# EAGLE design backplane_v1.1-nochips (EAGLE 6.6.0)
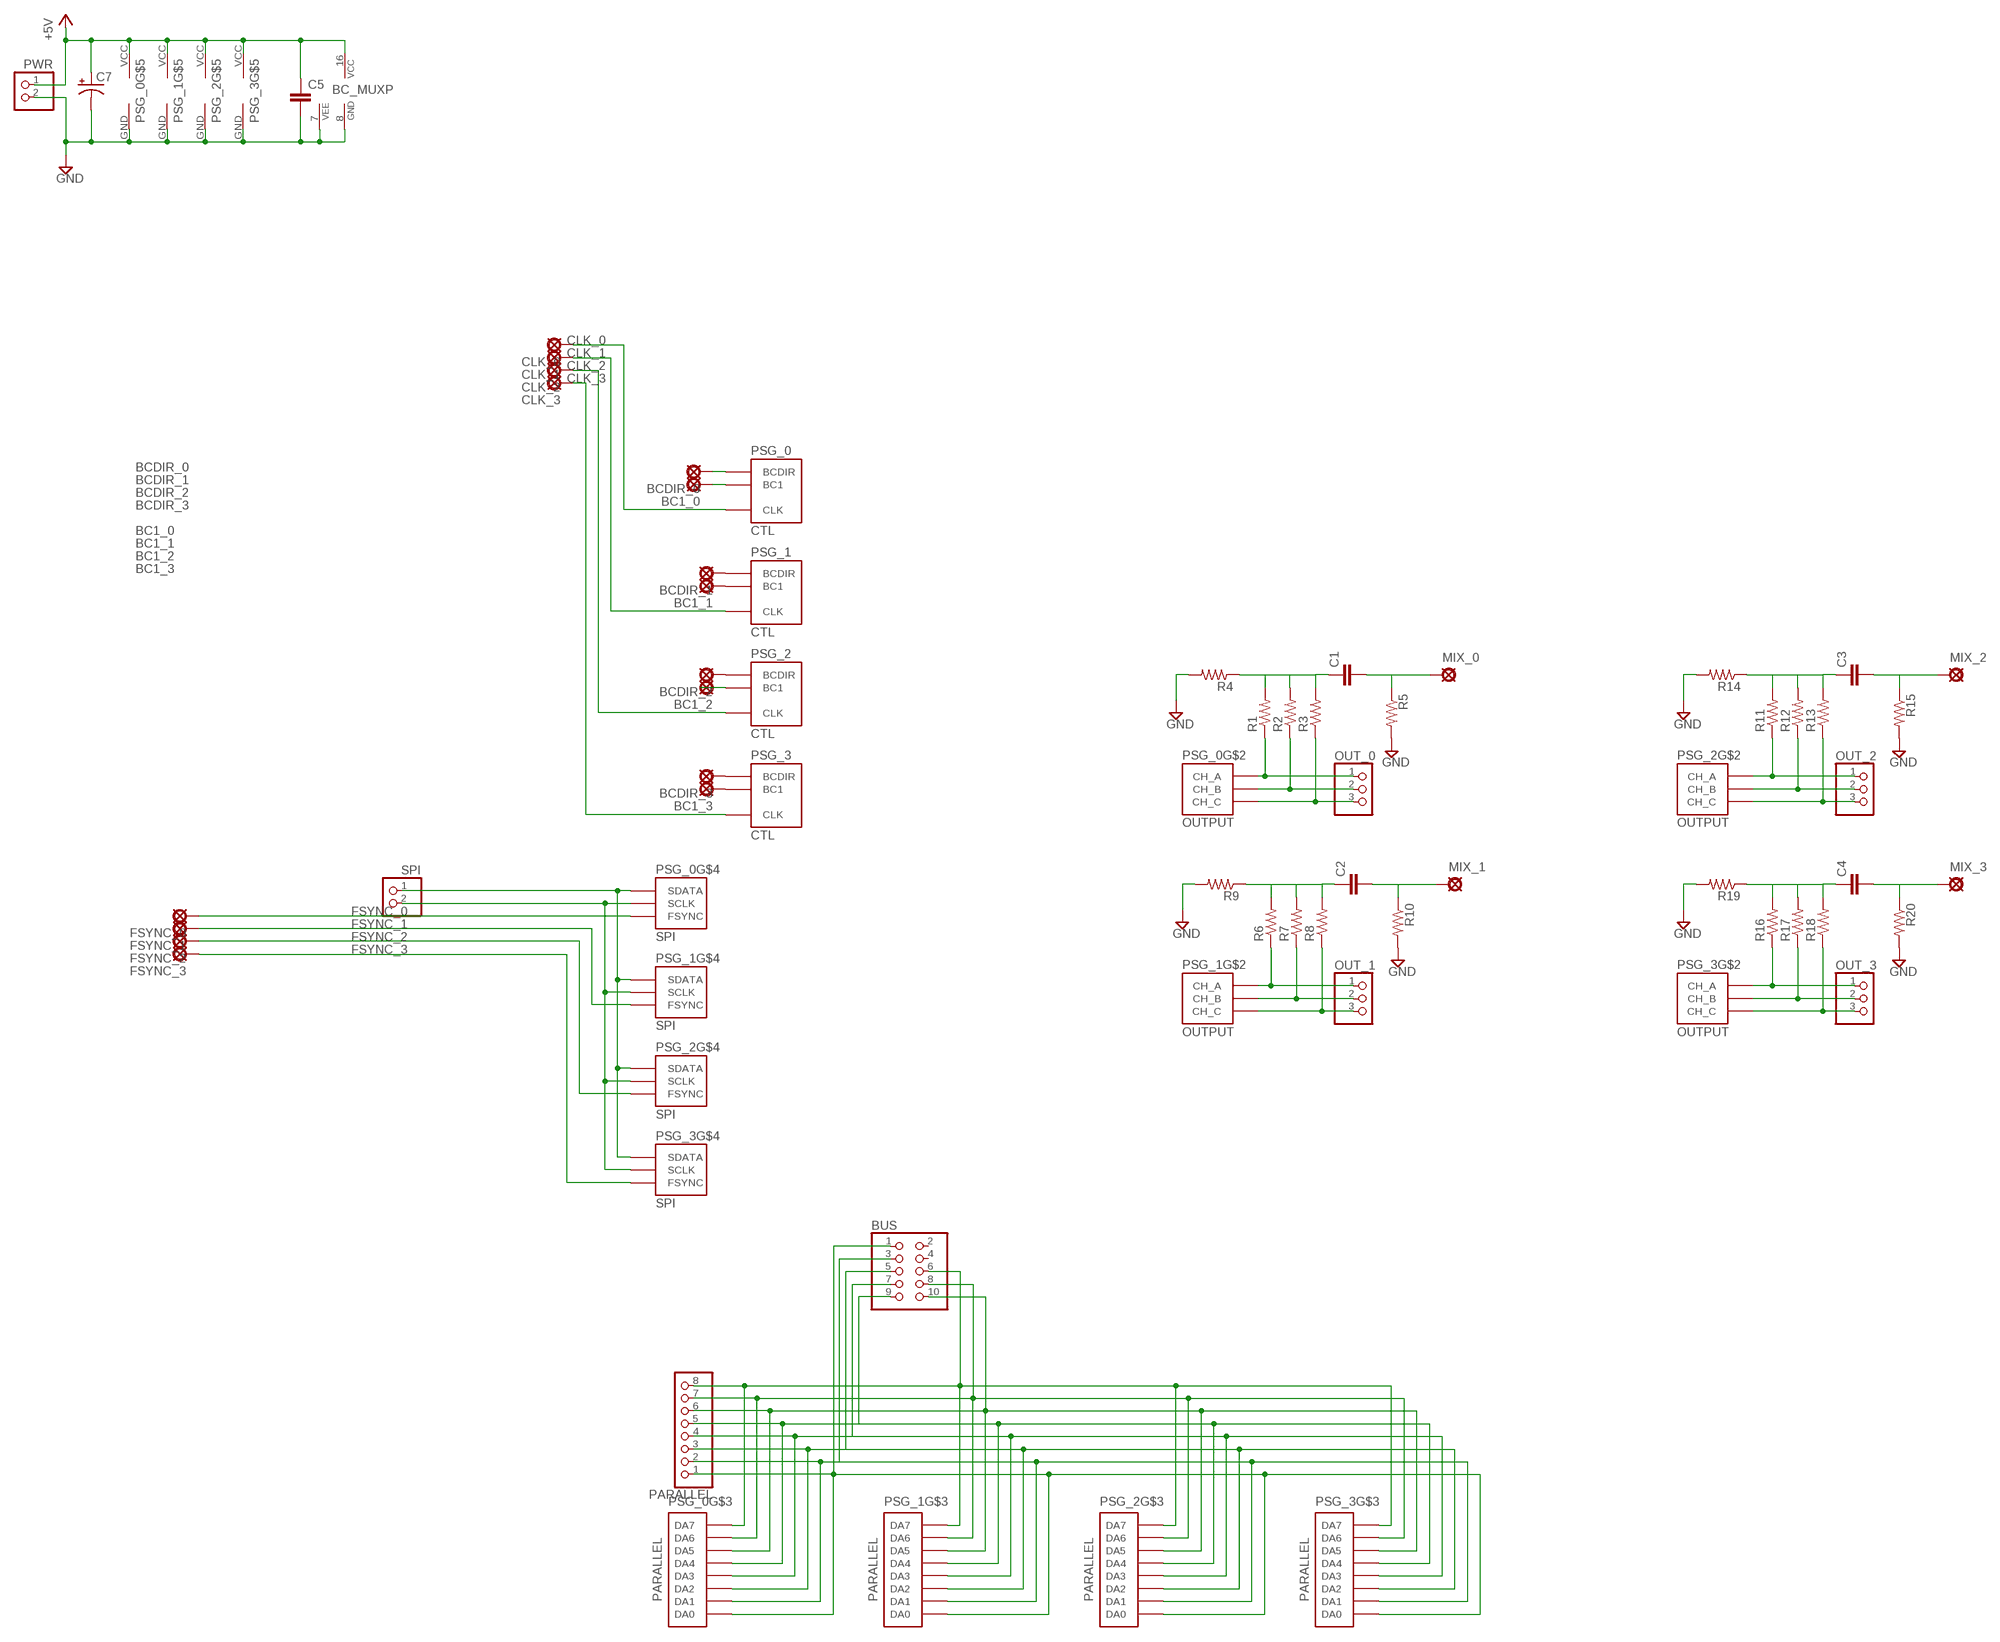
[diagram p0: schematic, sheet 1]

## Parts
BC1_0  PAD  [SQUARE]
BC1_1  PAD  [SQUARE]
BC1_2  PAD  [SQUARE]
BC1_3  PAD  [SQUARE]
BC_MUX  4052N  [DIL16]
BCDIR_0  PAD  [SQUARE]
BCDIR_1  PAD  [SQUARE]
BCDIR_2  PAD  [SQUARE]
BCDIR_3  PAD  [SQUARE]
BUS  PINHD-2X5IDC  [10PIN_IDC]
C1  070X0302  [070X030]
C2  070X0302  [070X030]
C3  070X0302  [070X030]
C4  070X0302  [070X030]
C5  050X030_0251  [050X030_025]
C7  0631  [063_025]
CLK_0  PAD  [SQUARE]
CLK_1  PAD  [SQUARE]
CLK_2  PAD  [SQUARE]
CLK_3  PAD  [SQUARE]
FSYNC_0  PAD  [SQUARE]
FSYNC_1  PAD  [SQUARE]
FSYNC_2  PAD  [SQUARE]
FSYNC_3  PAD  [SQUARE]
MIX_0  PAD  [SQUARE]
MIX_1  PAD  [SQUARE]
MIX_2  PAD  [SQUARE]
MIX_3  PAD  [SQUARE]
OUT_0  PINHD-1X3  [1X03]
OUT_1  PINHD-1X3  [1X03]
OUT_2  PINHD-1X3  [1X03]
OUT_3  PINHD-1X3  [1X03]
PARALLEL  PINHD-1X8  [1X08]
PSG_0  PSG_DAUGHTER  [PSG_DAUGHTER]
PSG_1  PSG_DAUGHTER  [PSG_DAUGHTER]
PSG_2  PSG_DAUGHTER  [PSG_DAUGHTER]
PSG_3  PSG_DAUGHTER  [PSG_DAUGHTER]
PWR  PINHD-1X2  [1X02]
R1  6MM.3  [R0207/3]
R2  6MM.3  [R0207/3]
R3  6MM.3  [R0207/3]
R4  6MM.3  [R0207/3]
R5  6MM.3  [R0207/3]
R6  6MM.3  [R0207/3]
R7  6MM.3  [R0207/3]
R8  6MM.3  [R0207/3]
R9  6MM.3  [R0207/3]
R10  6MM.3  [R0207/3]
R11  6MM.3  [R0207/3]
R12  6MM.3  [R0207/3]
R13  6MM.3  [R0207/3]
R14  6MM.3  [R0207/3]
R15  6MM.3  [R0207/3]
R16  6MM.3  [R0207/3]
R17  6MM.3  [R0207/3]
R18  6MM.3  [R0207/3]
R19  6MM.3  [R0207/3]
R20  6MM.3  [R0207/3]
SPI  PINHD-1X2  [1X02]

## Nets
+5V: BC_MUX.16(VCC) C5.1 C7.+ PSG_0.VCC PSG_1.VCC PSG_2.VCC PSG_3.VCC PWR.1
BC1_0: BC1_0.1(PAD) PSG_0.BC1
BC1_1: BC1_1.1(PAD) PSG_1.BC1
BC1_2: BC1_2.1(PAD) PSG_2.BC1
BC1_3: BC1_3.1(PAD) PSG_3.BC1
BCDIR_0: BCDIR_0.1(PAD) PSG_0.BCDIR
BCDIR_1: BCDIR_1.1(PAD) PSG_1.BCDIR
BCDIR_2: BCDIR_2.1(PAD) PSG_2.BCDIR
BCDIR_3: BCDIR_3.1(PAD) PSG_3.BCDIR
CLK_0: CLK_0.1(PAD) PSG_0.CLK
CLK_1: CLK_1.1(PAD) PSG_1.CLK
CLK_2: CLK_2.1(PAD) PSG_2.CLK
CLK_3: CLK_3.1(PAD) PSG_3.CLK
FSYNC_0: FSYNC_0.1(PAD) PSG_0.FSYNC
FSYNC_1: FSYNC_1.1(PAD) PSG_1.FSYNC
FSYNC_2: FSYNC_2.1(PAD) PSG_2.FSYNC
FSYNC_3: FSYNC_3.1(PAD) PSG_3.FSYNC
GND: BC_MUX.7(VEE) BC_MUX.8(GND) C5.2 C7.- PSG_0.GND PSG_1.GND PSG_2.GND PSG_3.GND PWR.2 R4.2 R5.2 R9.2 R10.2 R14.2 R15.2 R19.2 R20.2
N$1: C1.1 R1.2 R2.2 R3.2 R4.1
N$5: C1.2 MIX_0.1(PAD) R5.1
N$8: C2.1 R6.2 R7.2 R8.2 R9.1
N$9: C2.2 MIX_1.1(PAD) R10.1
N$13: C3.1 R11.2 R12.2 R13.2 R14.1
N$14: C3.2 MIX_2.1(PAD) R15.1
N$16: BUS.6 PARALLEL.8 PSG_0.DA7 PSG_1.DA7 PSG_2.DA7 PSG_3.DA7
N$17: BUS.1 PARALLEL.1 PSG_0.DA0 PSG_1.DA0 PSG_2.DA0 PSG_3.DA0
N$18: BUS.3 PARALLEL.2 PSG_0.DA1 PSG_1.DA1 PSG_2.DA1 PSG_3.DA1
N$19: BUS.5 PARALLEL.3 PSG_0.DA2 PSG_1.DA2 PSG_2.DA2 PSG_3.DA2
N$20: BUS.7 PARALLEL.4 PSG_0.DA3 PSG_1.DA3 PSG_2.DA3 PSG_3.DA3
N$21: BUS.9 PARALLEL.5 PSG_0.DA4 PSG_1.DA4 PSG_2.DA4 PSG_3.DA4
N$22: BUS.10 PARALLEL.6 PSG_0.DA5 PSG_1.DA5 PSG_2.DA5 PSG_3.DA5
N$23: BUS.8 PARALLEL.7 PSG_0.DA6 PSG_1.DA6 PSG_2.DA6 PSG_3.DA6
N$24: OUT_0.1 PSG_0.OUT_A(CH_A) R1.1
N$25: OUT_0.2 PSG_0.OUT_B(CH_B) R2.1
N$26: OUT_0.3 PSG_0.OUT_C(CH_C) R3.1
N$27: OUT_1.1 PSG_1.OUT_A(CH_A) R6.1
N$28: OUT_1.2 PSG_1.OUT_B(CH_B) R7.1
N$29: OUT_1.3 PSG_1.OUT_C(CH_C) R8.1
N$30: OUT_2.1 PSG_2.OUT_A(CH_A) R11.1
N$31: OUT_2.2 PSG_2.OUT_B(CH_B) R12.1
N$32: OUT_2.3 PSG_2.OUT_C(CH_C) R13.1
N$33: OUT_3.1 PSG_3.OUT_A(CH_A) R16.1
N$34: OUT_3.2 PSG_3.OUT_B(CH_B) R17.1
N$35: OUT_3.3 PSG_3.OUT_C(CH_C) R18.1
N$38: C4.1 R16.2 R17.2 R18.2 R19.1
N$39: C4.2 MIX_3.1(PAD) R20.1
SCLK: PSG_0.SCLK PSG_1.SCLK PSG_2.SCLK PSG_3.SCLK SPI.2
SDATA: PSG_0.SDATA PSG_1.SDATA PSG_2.SDATA PSG_3.SDATA SPI.1
Unconnected: BC_MUX.1(Y0) BC_MUX.2(Y2) BC_MUX.3(Y) BC_MUX.4(Y3) BC_MUX.5(Y1) BC_MUX.6(INH) BC_MUX.9(B) BC_MUX.10(A) BC_MUX.11(X3) BC_MUX.12(X0) BC_MUX.13(X) BC_MUX.14(X1) BC_MUX.15(X2) BUS.2 BUS.4

## Library data of the parts
BC1_0 BC1_1-BC1_3 BCDIR_0 BCDIR_1-BCDIR_3 CLK_0 CLK_1-CLK_3 FSYNC_0 FSYNC_1-FSYNC_3 MIX_0 MIX_1-MIX_3 = gm-supply:PAD: PAD use this package for pads with any purpose, including input, output, send or return various pad shapes: round, square, octogonal, long, and long offset
BC_MUX = 40xx:4052: Dual 4-channel ANALOG MULTIPLEXER
BUS = jaapie:PINHD-2X5: PIN HEADER
C1-C4 = gm-caps-film-chicklet:070X030: 0.0001 - .01uF (100 - 10,000pF) Panasonic ECQ-B 7mm x 3mm 50 or 63V: 0.0001 - .01uF (100 - 10,000pF);
C5 = gm-caps-ceramic:050X030_025: 47 - 120pF Xicon Ceramic Disc 2.5mm lead spacing
C7 = gm-caps-electro-pol:063: 33 - 220uF Xicon values at Mouser.com 10V: 220uF; 16V: 100uF; 25V: 100uF; 50V: 33uF
OUT_0 OUT_1-OUT_3 = pinhead:PINHD-1X3: PIN HEADER
PARALLEL = pinhead:PINHD-1X8: PIN HEADER
PSG_0 PSG_1-PSG_3 = jaapie:PSG_DAUGHTER
PWR SPI = pinhead:PINHD-1X2: PIN HEADER
R1-R20 = gm-resistors:6MM: 6mm Resistors Leads spaced 1-6 holes apart for 0.1" perfboard. Suitable for 1/4 watt resistors.

## Board
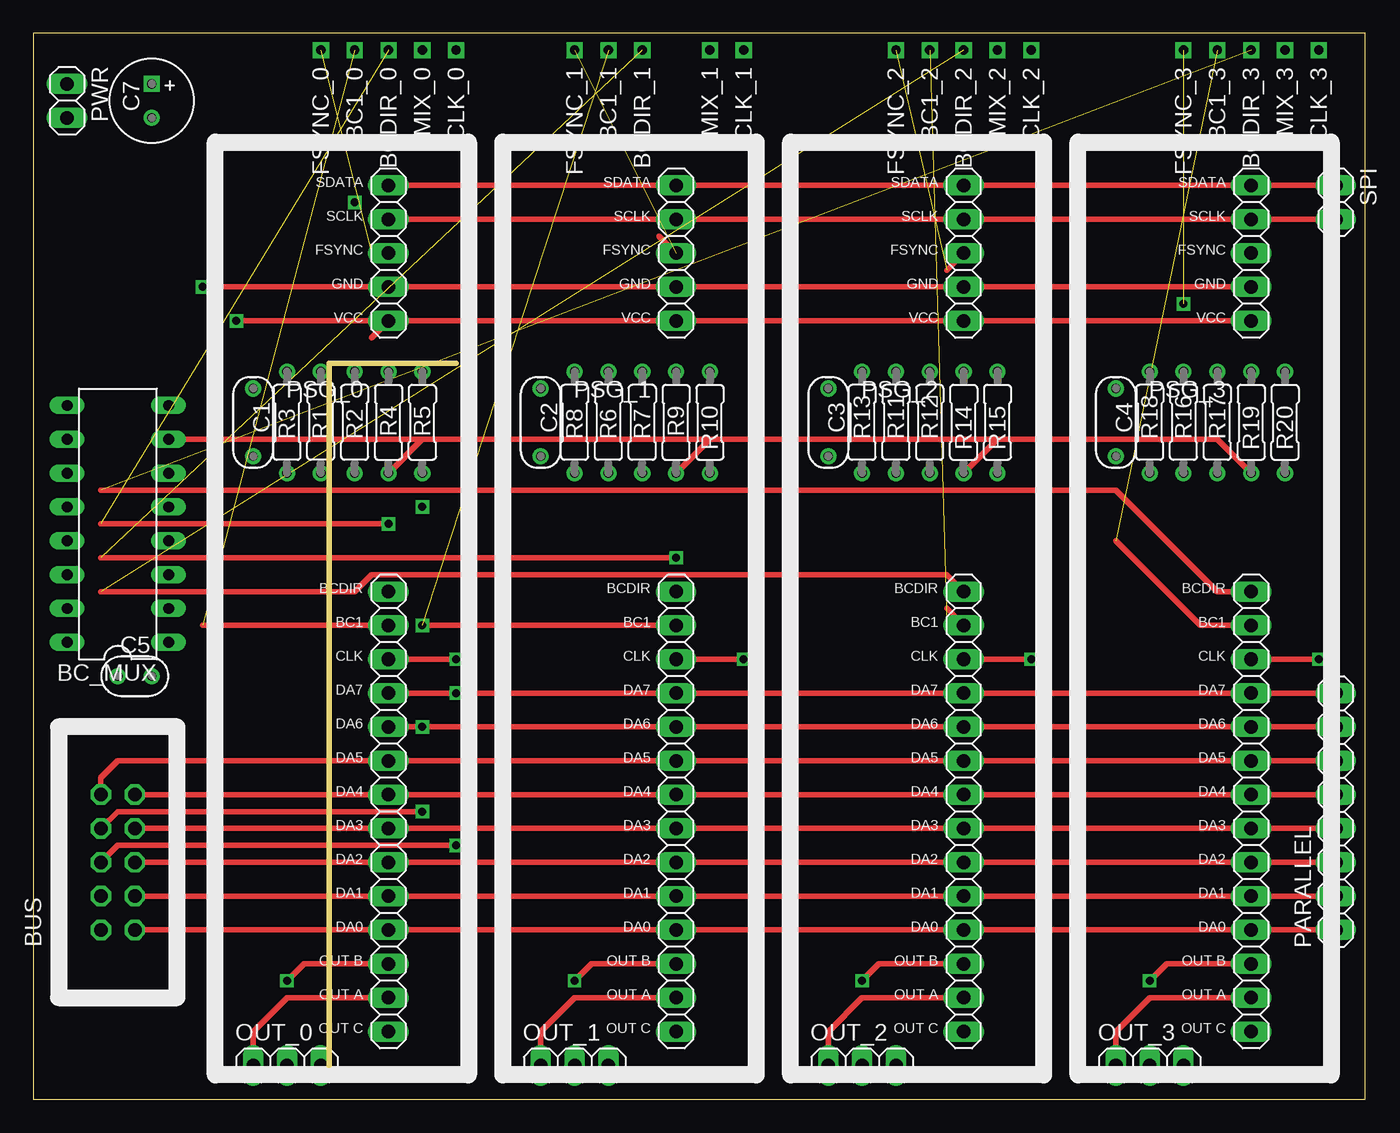
[diagram p1: board, top side]
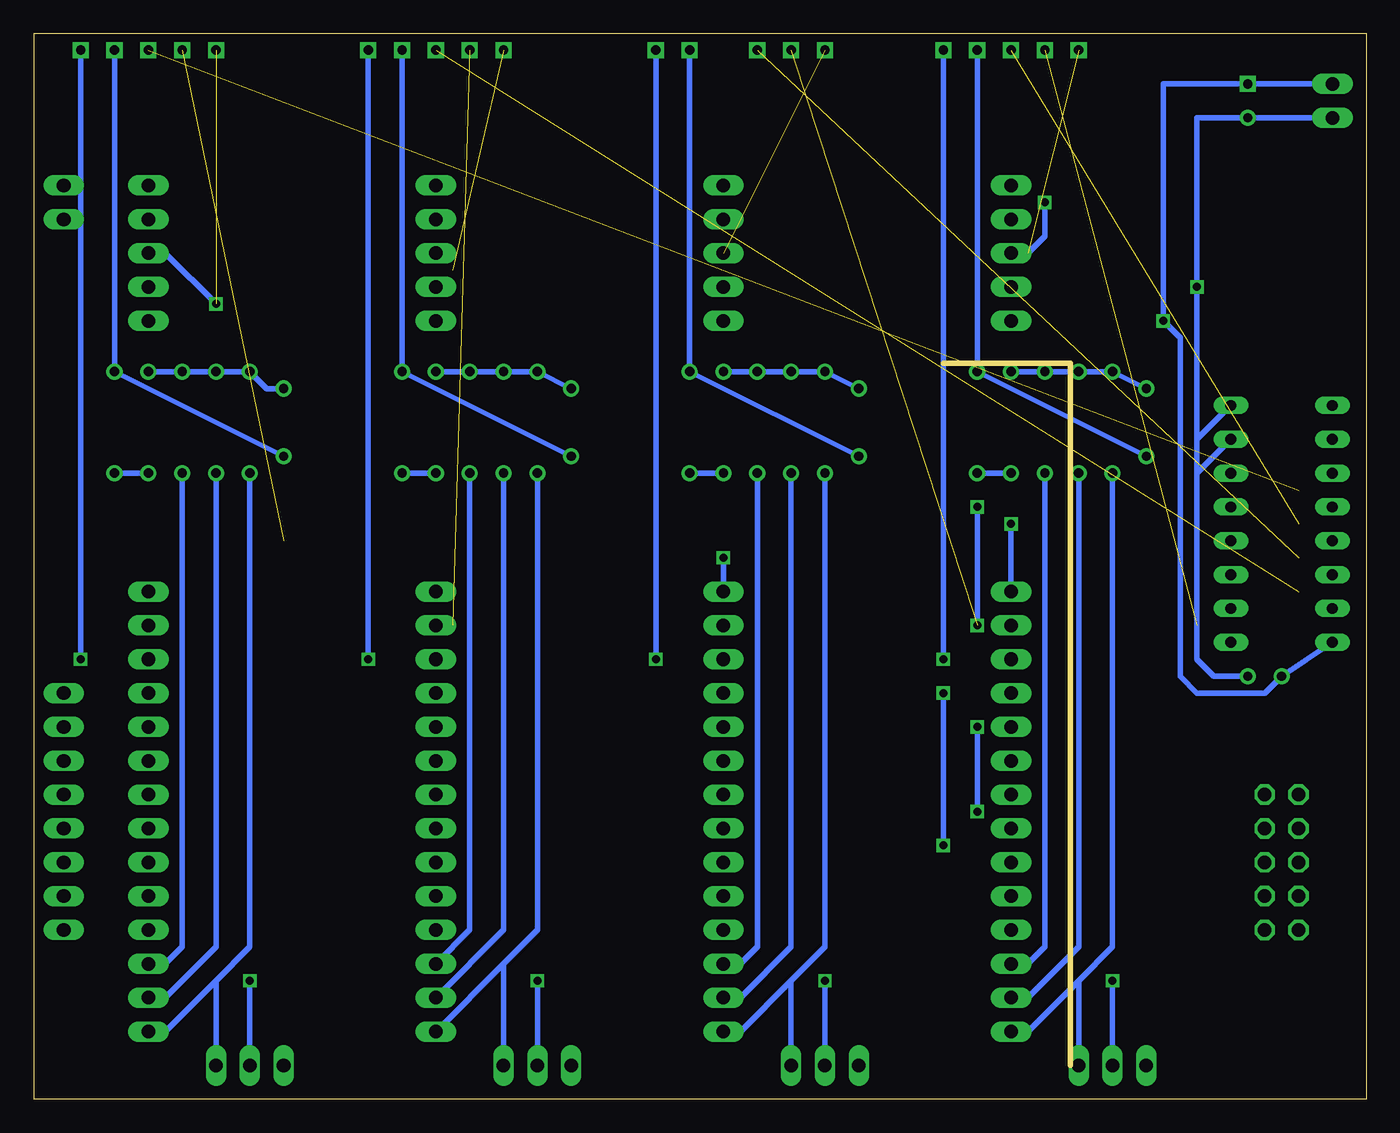
[diagram p2: board, bottom side, seen from below]

Size 100 x 80 mm. Coordinates in mm from the lower left corner, seen from the top.
Outline: 22.23,2.54 22.23,55.24 31.75,55.24
Outline: 0,0 100,0 100,80 0,80 0,0
Copper layers (1*16): Top 0.035mm / dielectric 1.5mm / Bottom 0.035mm
Design rules "default": minimum track width 10mil, minimum drill 24mil, track to track 8mil, track to pad 8mil, pad to pad 8mil, via to via 8mil, smd to smd 8mil, copper to edge 40mil, drill to drill 8mil, minimum pad ring 10mil, minimum via ring 8mil, stop-mask expansion 4mil, vias tented up to drill 0mil, thermal gap 10mil

### Footprints (pad centres in the part's own frame; a part is rotated, then mirrored left to right if it is on the bottom)
SQUARE = drill 0.7 square: 1 0,0
DIL16 = drill 0.813 long: 1 -8.89,-3.81; 2 -6.35,-3.81; 3 -3.81,-3.81; 4 -1.27,-3.81; 5 1.27,-3.81; 6 3.81,-3.81; 7 6.35,-3.81; 8 8.89,-3.81; 9 8.89,3.81; 10 6.35,3.81; 11 3.81,3.81; 12 1.27,3.81; 13 -1.27,3.81; 14 -3.81,3.81; 15 -6.35,3.81; 16 -8.89,3.81
10PIN_IDC = drill 1.016 octagon: 1 -5.08,-1.27; 2 -5.08,1.27; 3 -2.54,-1.27; 4 -2.54,1.27; 5 0,-1.27; 6 0,1.27; 7 2.54,-1.27; 8 2.54,1.27; 9 5.08,-1.27; 10 5.08,1.27
070X030 = drill 0.7: 1 -2.54,0; 2 2.54,0
050X030_025 = drill 0.7: 1 -1.27,0; 2 1.27,0
063_025 = drill 0.7 square: + -1.27,0 | drill 0.7: - 1.27,0
1X03 = drill 1.016 long: 1 -2.54,0; 2 0,0; 3 2.54,0
1X08 = drill 1.016 long: 1 -8.89,0; 2 -6.35,0; 3 -3.81,0; 4 -1.27,0; 5 1.27,0; 6 3.81,0; 7 6.35,0; 8 8.89,0
PSG_DAUGHTER = drill 1.016 long: BC1 0,-1.27; BCDIR 0,1.27; CLK 0,-3.81; DA0 0,-24.13; DA1 0,-21.59; DA2 0,-19.05; DA3 0,-16.51; DA4 0,-13.97; DA5 0,-11.43; DA6 0,-8.89; DA7 0,-6.35; FSYNC 0,26.67; GND 0,24.13; OUT_A 0,-29.21; OUT_B 0,-26.67; OUT_C 0,-31.75; SCLK 0,29.21; SDATA 0,31.75; VCC 0,21.59
1X02 = drill 1.016 long: 1 -1.27,0; 2 1.27,0
R0207/3 = drill 0.7: 1 -3.81,0; 2 3.81,0

### Placement (x,y rotation side)
BC1_0  24.13,78.74 270 top
BC1_1  43.18,78.74 270 top
BC1_2  67.31,78.74 270 top
BC1_3  88.9,78.74 270 top
BC_MUX  6.35,43.18 90 top
BCDIR_0  26.67,78.74 270 top
BCDIR_1  45.72,78.74 270 top
BCDIR_2  69.85,78.74 270 top
BCDIR_3  91.44,78.74 270 top
BUS  6.35,17.78 90 top
C1  16.51,50.8 270 top
C2  38.1,50.8 270 top
C3  59.69,50.8 270 top
C4  81.28,50.8 270 top
C5  7.62,31.75 0 top
C7  8.89,74.93 270 top
CLK_0  31.75,78.74 270 top
CLK_1  53.34,78.74 270 top
CLK_2  74.93,78.74 270 top
CLK_3  96.52,78.74 270 top
FSYNC_0  21.59,78.74 270 top
FSYNC_1  40.64,78.74 270 top
FSYNC_2  64.77,78.74 270 top
FSYNC_3  86.36,78.74 270 top
MIX_0  29.21,78.74 270 top
MIX_1  50.8,78.74 270 top
MIX_2  72.39,78.74 270 top
MIX_3  93.98,78.74 270 top
OUT_0  19.05,2.54 0 top
OUT_1  40.64,2.54 0 top
OUT_2  62.23,2.54 0 top
OUT_3  83.82,2.54 0 top
PARALLEL  97.79,21.59 90 top
PSG_0  26.67,36.83 0 top
PSG_1  48.26,36.83 0 top
PSG_2  69.85,36.83 0 top
PSG_3  91.44,36.83 0 top
PWR  2.54,74.93 270 top
R1  21.59,50.8 90 top
R2  24.13,50.8 90 top
R3  19.05,50.8 90 top
R4  26.67,50.8 270 top
R5  29.21,50.8 270 top
R6  43.18,50.8 90 top
R7  45.72,50.8 90 top
R8  40.64,50.8 90 top
R9  48.26,50.8 270 top
R10  50.8,50.8 270 top
R11  64.77,50.8 90 top
R12  67.31,50.8 90 top
R13  62.23,50.8 90 top
R14  69.85,50.8 270 top
R15  72.39,50.8 270 top
R16  86.36,50.8 90 top
R17  88.9,50.8 90 top
R18  83.82,50.8 90 top
R19  91.44,50.8 270 top
R20  93.98,50.8 270 top
SPI  97.79,67.31 270 top

### Tracks (layer width: path | path; a pad name or v marks a point on that pad's centre or on a via)
+5V  (via drill 0.6)
  Top 0.406: PSG_3.VCC PSG_2.VCC PSG_1.VCC PSG_0.VCC | PSG_0.VCC 25.4,57.15 | PSG_0.VCC v15.24,58.42
  Bottom 0.406: BC_MUX.16 C5.1 7.62,30.48 12.7,30.48 13.97,31.75 13.97,57.15 v15.24,58.42 15.24,76.2 C7.+ PWR.1
BC1_0  (1 unrouted)
  Top 0.406: PSG_0.BC1 12.7,35.56
BC1_1  (via drill 0.6)  (1 unrouted)
  Top 0.406: v29.21,35.56 PSG_1.BC1
  Bottom 0.406: v29.21,44.45 v29.21,35.56
BC1_2  (1 unrouted)
  Top 0.406: 68.58,35.56 PSG_2.BC1 68.58,36.83
BC1_3  (1 unrouted)
  Top 0.406: 81.28,41.91 87.63,35.56 PSG_3.BC1
BCDIR_0  (via drill 0.6)  (1 unrouted)
  Top 0.406: 5.08,43.18 v26.67,43.18
  Bottom 0.406: PSG_0.BCDIR v26.67,43.18
BCDIR_1  (via drill 0.6)  (1 unrouted)
  Top 0.406: 5.08,40.64 v48.26,40.64
  Bottom 0.406: v48.26,40.64 PSG_1.BCDIR
BCDIR_2  (1 unrouted)
  Top 0.406: PSG_2.BCDIR 68.58,39.37 25.4,39.37 24.13,38.1 5.08,38.1
BCDIR_3  (1 unrouted)
  Top 0.406: 5.08,45.72 81.28,45.72 88.9,38.1 PSG_3.BCDIR
CLK_0  (via drill 0.6)
  Top 0.406: PSG_0.CLK v31.75,33.02
  Bottom 0.406: v31.75,33.02 CLK_0.1
CLK_1  (via drill 0.6)
  Top 0.406: PSG_1.CLK v53.34,33.02
  Bottom 0.406: v53.34,33.02 CLK_1.1
CLK_2  (via drill 0.6)
  Top 0.406: PSG_2.CLK v74.93,33.02
  Bottom 0.406: v74.93,33.02 CLK_2.1
CLK_3  (via drill 0.6)
  Top 0.406: PSG_3.CLK v96.52,33.02
  Bottom 0.406: v96.52,33.02 CLK_3.1
FSYNC_0  (via drill 0.6)  (1 unrouted)
  Bottom 0.406: v24.13,67.31 24.13,64.77 25.4,63.5 PSG_0.FSYNC
FSYNC_1  (1 unrouted)
  Top 0.406: PSG_1.FSYNC 46.99,64.77
FSYNC_2  (1 unrouted)
  Top 0.406: PSG_2.FSYNC 68.58,62.23
FSYNC_3  (via drill 0.6)  (1 unrouted)
  Bottom 0.406: v86.36,59.69 90.17,63.5 PSG_3.FSYNC
GND  (via drill 0.6)
  Top 0.406: R14.2 72.39,49.53 | 50.8,49.53 29.21,49.53 | 72.39,49.53 88.9,49.53 R19.2 | R9.2 50.8,49.53 | 50.8,49.53 72.39,49.53 | R4.2 29.21,49.53 | 29.21,49.53 BC_MUX.7 | PSG_3.GND PSG_2.GND PSG_1.GND PSG_0.GND v12.7,60.96
  Bottom 0.406: R19.2 R20.2 | R5.2 R4.2 | R9.2 R10.2 | R14.2 R15.2 | PWR.2 C7.- 12.7,73.66 v12.7,60.96 12.7,49.53 | C5.2 11.43,31.75 12.7,33.02 12.7,46.99 | 12.7,46.99 BC_MUX.7 | 12.7,49.53 12.7,46.99 | BC_MUX.8 12.7,49.53
N$1
  Bottom 0.406: R4.1 R2.2 R1.2 R3.2 C1.1
N$5
  Bottom 0.406: C1.2 R5.1 MIX_0.1
N$8
  Bottom 0.406: R9.1 R8.2 | R8.2 R6.2 R7.2 | C2.1 R8.2
N$9
  Bottom 0.406: C2.2 R10.1 MIX_1.1
N$13
  Bottom 0.406: R14.1 R12.2 R11.2 R13.2 C3.1
N$14
  Bottom 0.406: C3.2 R15.1 MIX_2.1
N$16  (via drill 0.6)
  Top 0.406: PSG_0.DA7 v31.75,30.48 PSG_1.DA7 PSG_2.DA7 PSG_3.DA7 PARALLEL.8 | BUS.6 6.35,19.05 v31.75,19.05
  Bottom 0.406: v31.75,30.48 v31.75,19.05
N$17
  Top 0.406: PARALLEL.1 PSG_3.DA0 PSG_2.DA0 PSG_1.DA0 PSG_0.DA0 BUS.1
N$18
  Top 0.406: PARALLEL.2 PSG_3.DA1 PSG_2.DA1 PSG_1.DA1 PSG_0.DA1 BUS.3
N$19
  Top 0.406: PARALLEL.3 PSG_3.DA2 PSG_2.DA2 PSG_1.DA2 PSG_0.DA2 BUS.5
N$20
  Top 0.406: PARALLEL.4 PSG_3.DA3 PSG_2.DA3 PSG_1.DA3 PSG_0.DA3 BUS.7
N$21
  Top 0.406: PARALLEL.5 PSG_3.DA4 PSG_2.DA4 PSG_1.DA4 PSG_0.DA4 BUS.9
N$22
  Top 0.406: PARALLEL.6 PSG_3.DA5 PSG_2.DA5 PSG_1.DA5 PSG_0.DA5 6.35,25.4 5.08,24.13 BUS.10
N$23  (via drill 0.6)
  Top 0.406: PSG_0.DA6 v29.21,27.94 PSG_1.DA6 PSG_2.DA6 PSG_3.DA6 PARALLEL.7 | BUS.8 6.35,21.59 v29.21,21.59
  Bottom 0.406: v29.21,27.94 v29.21,21.59
N$24
  Top 0.406: OUT_0.1 16.51,5.08 19.05,7.62 PSG_0.OUT_A
  Bottom 0.406: PSG_0.OUT_A 25.4,7.62 21.59,11.43 R1.1
N$25  (via drill 0.6)
  Top 0.406: v19.05,8.89 20.32,10.16 PSG_0.OUT_B
  Bottom 0.406: R2.1 24.13,11.43 25.4,10.16 PSG_0.OUT_B | OUT_0.2 v19.05,8.89
N$26
  Bottom 0.406: R3.1 19.05,11.43 21.59,8.89 | 21.59,8.89 25.4,5.08 PSG_0.OUT_C | OUT_0.3 21.59,8.89
N$27
  Top 0.406: OUT_1.1 38.1,5.08 40.64,7.62 PSG_1.OUT_A
  Bottom 0.406: PSG_1.OUT_A 46.99,7.62 43.18,11.43 R6.1
N$28  (via drill 0.6)
  Top 0.406: v40.64,8.89 41.91,10.16 PSG_1.OUT_B
  Bottom 0.406: R7.1 45.72,11.43 46.99,10.16 PSG_1.OUT_B | OUT_1.2 v40.64,8.89
N$29
  Bottom 0.406: PSG_1.OUT_C 46.99,5.08 43.18,8.89 | 43.18,8.89 40.64,11.43 R8.1 | OUT_1.3 43.18,8.89
N$30
  Top 0.406: OUT_2.1 59.69,5.08 62.23,7.62 PSG_2.OUT_A
  Bottom 0.406: 68.58,7.62 PSG_2.OUT_A 64.77,12.7 R11.1
N$31  (via drill 0.6)
  Top 0.406: v62.23,8.89 63.5,10.16 PSG_2.OUT_B
  Bottom 0.406: PSG_2.OUT_B 67.31,12.7 R12.1 | OUT_2.2 v62.23,8.89
N$32
  Bottom 0.406: 68.58,5.08 PSG_2.OUT_C 64.77,10.16 | 64.77,10.16 62.23,12.7 R13.1 | OUT_2.3 64.77,10.16
N$33
  Top 0.406: PSG_3.OUT_A 83.82,7.62 81.28,5.08 OUT_3.1
  Bottom 0.406: PSG_3.OUT_A 90.17,7.62 86.36,11.43 R16.1
N$34  (via drill 0.6)
  Top 0.406: PSG_3.OUT_B 85.09,10.16 v83.82,8.89
  Bottom 0.406: R17.1 88.9,11.43 90.17,10.16 PSG_3.OUT_B | v83.82,8.89 OUT_3.2
N$35
  Bottom 0.406: PSG_3.OUT_C 90.17,5.08 86.36,8.89 | 86.36,8.89 83.82,11.43 R18.1 | OUT_3.3 86.36,8.89
N$38
  Bottom 0.406: R19.1 R17.2 R16.2 R18.2 82.55,53.34 C4.1
N$39
  Bottom 0.406: C4.2 R20.1 MIX_3.1
SCLK
  Top 0.406: PSG_0.SCLK PSG_1.SCLK PSG_2.SCLK 90.17,66.04 PSG_3.SCLK SPI.2
SDATA
  Top 0.406: PSG_0.SDATA PSG_1.SDATA PSG_2.SDATA PSG_3.SDATA SPI.1